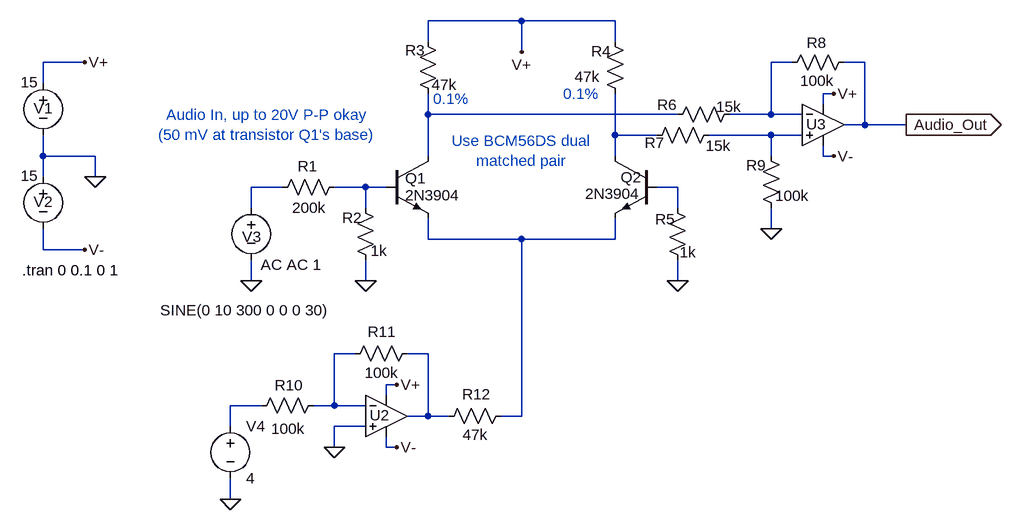
[diagram p0: schematic VCA-simulation.asc]
VCA-simulation.asc, the LTspice schematic file:
Version 4
SHEET 1 2860 1860
WIRE 1872 -16 1728 -16
WIRE 2016 -16 1872 -16
WIRE 1728 16 1728 -16
WIRE 2016 16 2016 -16
WIRE 1872 32 1872 -16
WIRE 1200 48 1136 48
WIRE 2288 48 2256 48
WIRE 2400 48 2368 48
WIRE 1136 80 1136 48
WIRE 2352 96 2336 96
WIRE 2336 112 2336 96
WIRE 1728 128 1728 96
WIRE 2112 128 1728 128
WIRE 2256 128 2256 48
WIRE 2256 128 2192 128
WIRE 2304 128 2256 128
WIRE 2400 144 2400 48
WIRE 2400 144 2368 144
WIRE 2464 144 2400 144
WIRE 2016 160 2016 96
WIRE 2080 160 2016 160
WIRE 2256 160 2160 160
WIRE 2304 160 2256 160
WIRE 1136 192 1136 160
WIRE 1216 192 1136 192
WIRE 1728 192 1728 128
WIRE 2016 192 2016 160
WIRE 2256 192 2256 160
WIRE 2336 192 2336 176
WIRE 2352 192 2336 192
WIRE 1136 224 1136 192
WIRE 1216 224 1216 192
WIRE 1504 240 1456 240
WIRE 1632 240 1584 240
WIRE 1664 240 1632 240
WIRE 2112 240 2080 240
WIRE 1456 272 1456 240
WIRE 1632 272 1632 240
WIRE 2112 272 2112 240
WIRE 2256 304 2256 272
WIRE 1728 320 1728 288
WIRE 1872 320 1728 320
WIRE 2016 320 2016 288
WIRE 2016 320 1872 320
WIRE 1136 336 1136 304
WIRE 1200 336 1136 336
WIRE 1456 384 1456 352
WIRE 1632 384 1632 352
WIRE 2112 384 2112 352
WIRE 1616 496 1584 496
WIRE 1728 496 1696 496
WIRE 1680 544 1664 544
WIRE 1664 560 1664 544
WIRE 1472 576 1424 576
WIRE 1584 576 1584 496
WIRE 1584 576 1552 576
WIRE 1632 576 1584 576
WIRE 1728 592 1728 496
WIRE 1728 592 1696 592
WIRE 1760 592 1728 592
WIRE 1872 592 1872 320
WIRE 1872 592 1840 592
WIRE 1424 608 1424 576
WIRE 1632 608 1584 608
WIRE 1584 640 1584 608
WIRE 1664 640 1664 624
WIRE 1680 640 1664 640
WIRE 1424 720 1424 688
FLAG 1216 224 0
FLAG 1200 48 V+
FLAG 1200 336 V-
FLAG 1680 544 V+
FLAG 1680 640 V-
FLAG 1584 640 0
FLAG 2112 384 0
FLAG 1632 384 0
FLAG 1872 32 V+
FLAG 2352 96 V+
FLAG 2352 192 V-
FLAG 2256 304 0
FLAG 1424 720 0
FLAG 1456 384 0
FLAG 2464 144 Audio_Out
IOPIN 2464 144 Out
SYMBOL voltage 1136 208 M0
WINDOW 0 0 70 Bottom 2
WINDOW 3 21 -1 Top 2
WINDOW 123 0 0 Left 2
WINDOW 39 -60 56 VBottom 2
SYMATTR InstName V2
SYMATTR Value 15
SYMBOL voltage 1136 64 M0
WINDOW 0 0 70 Bottom 2
WINDOW 3 21 -1 Top 2
WINDOW 123 0 0 Left 2
WINDOW 39 -60 56 VBottom 2
SYMATTR InstName V1
SYMATTR Value 15
SYMBOL UniversalOpamp2 1664 592 R0
WINDOW 0 -26 -1 Left 2
SYMATTR InstName U2
SYMBOL res 1712 480 R90
WINDOW 0 -2 55 VBottom 2
WINDOW 3 30 55 VTop 2
SYMATTR InstName R11
SYMATTR Value 100k
SYMBOL res 1568 560 R90
WINDOW 0 0 54 VBottom 2
WINDOW 3 36 55 VTop 2
SYMATTR InstName R10
SYMATTR Value 100k
SYMBOL res 1856 576 R90
WINDOW 0 -2 53 VBottom 2
WINDOW 3 29 55 VTop 2
SYMATTR InstName R12
SYMATTR Value 47k
SYMBOL npn 1664 192 R0
WINDOW 0 29 34 Left 2
WINDOW 3 29 60 Left 2
SYMATTR InstName Q1
SYMATTR Value 2N3904
SYMBOL npn 2080 192 M0
WINDOW 0 23 33 Left 2
WINDOW 3 25 58 Left 2
SYMATTR InstName Q2
SYMATTR Value 2N3904
SYMBOL res 1744 112 R180
WINDOW 0 20 83 Left 2
WINDOW 3 10 30 Right 2
SYMATTR InstName R3
SYMATTR Value 47k
SYMBOL res 2032 112 R180
WINDOW 0 22 81 Left 2
WINDOW 3 78 42 Right 2
SYMATTR InstName R4
SYMATTR Value 47k
SYMBOL res 2128 368 R180
WINDOW 0 20 79 Left 2
WINDOW 3 13 28 Right 2
SYMATTR InstName R5
SYMATTR Value 1k
SYMBOL res 1648 368 R180
WINDOW 0 21 81 Left 2
WINDOW 3 8 30 Right 2
SYMATTR InstName R2
SYMATTR Value 1k
SYMBOL res 1600 224 R90
WINDOW 0 -1 57 VBottom 2
WINDOW 3 32 55 VTop 2
SYMATTR InstName R1
SYMATTR Value 200k
SYMBOL res 2208 112 R90
WINDOW 0 17 112 VBottom 2
WINDOW 3 -11 17 VTop 2
SYMATTR InstName R6
SYMATTR Value 15k
SYMBOL res 2176 144 R90
WINDOW 0 43 99 VBottom 2
WINDOW 3 17 1 VTop 2
SYMATTR InstName R7
SYMATTR Value 15k
SYMBOL UniversalOpamp2 2336 144 R0
WINDOW 0 -26 -1 Left 2
SYMATTR InstName U3
SYMBOL res 2384 32 R90
WINDOW 0 1 58 VBottom 2
WINDOW 3 29 57 VTop 2
SYMATTR InstName R8
SYMATTR Value 100k
SYMBOL res 2272 288 R180
WINDOW 0 24 82 Left 2
WINDOW 3 10 35 Right 2
SYMATTR InstName R9
SYMATTR Value 100k
SYMBOL voltage 1456 256 R0
WINDOW 0 1 45 Top 2
WINDOW 3 -140 173 Left 2
WINDOW 123 61 119 Bottom 2
WINDOW 39 0 0 Left 0
SYMATTR InstName V3
SYMATTR Value SINE(0 10 300 0 0 0 30)
SYMATTR Value2 AC AC 1
SYMBOL Voltage 1424 592 R0
SYMATTR InstName V4
SYMATTR Value 4
TEXT 1104 368 Left 2 !.tran 0 0.1 0 1
TEXT 1480 144 Center 2 ;Audio In, up to 20V P-P okay\n(50 mV at transistor Q1's base)
TEXT 1736 104 Left 2 ;0.1%
TEXT 1936 96 Left 2 ;0.1%
TEXT 1872 184 Center 2 ;Use BCM56DS dual\nmatched pair
LINE Normal 1712 592 1712 592 1
LINE Normal 2384 144 2384 144 1

The netlist it stands for:
* VCA-simulation.asc
V2 0 V- 15
V1 V+ 0 15
XU2 0 N009 V+ V- N010 level.2 Avol=1Meg GBW=10Meg Slew=10Meg ilimit=25m rail=0 Vos=0 phimargin=45 en=0 enk=0 in=0 ink=0 Rin=500Meg  ; pins IN+ IN- V+ V- OUT
R11 N010 N009 100k
R10 N009 N011 100k
R12 N008 N010 47k
Q1 N002 N006 N008 0 2N3904
Q2 N003 N007 N008 0 2N3904
R3 N002 V+ 47k
R4 N003 V+ 47k
R5 0 N007 1k
R2 0 N006 1k
R1 N006 N005 200k
R6 N001 N002 15k
R7 N004 N003 15k
XU3 N004 N001 V+ V- Audio_Out level.2 Avol=1Meg GBW=10Meg Slew=10Meg ilimit=25m rail=0 Vos=0 phimargin=45 en=0 enk=0 in=0 ink=0 Rin=500Meg  ; pins IN+ IN- V+ V- OUT
R8 Audio_Out N001 100k
R9 0 N004 100k
V3 N005 0 SINE(0 10 300 0 0 0 30) AC AC 1
V4 N011 0 4
.model NPN NPN
.model PNP PNP
.lib standard.bjt
.tran 0 0.1 0 1
* Audio In, up to 20V P-P okay
* (50 mV at transistor Q1's base)
* 0.1%
* 0.1%
* Use BCM56DS dual
* matched pair
.lib UniversalOpamps2.sub
.backanno
.end